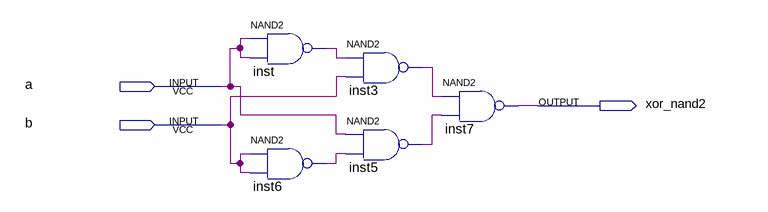
[diagram p0: schematic sheet]
// Quartus schematic xor_NAND2.bdf as structural Verilog: 5 symbols, 3 pins
module xor_NAND2 (
  input  a,
  input  b,
  output xor_nand2
);

  wire inst3_out, inst5_out, inst6_out, inst_out;

  nand inst (inst_out, a, a);
  nand inst6 (inst6_out, b, b);
  nand inst3 (inst3_out, inst_out, b);
  nand inst5 (inst5_out, a, inst6_out);
  nand inst7 (xor_nand2, inst3_out, inst5_out);
endmodule
